# EAGLE design board 2 (EAGLE 9.6.2)
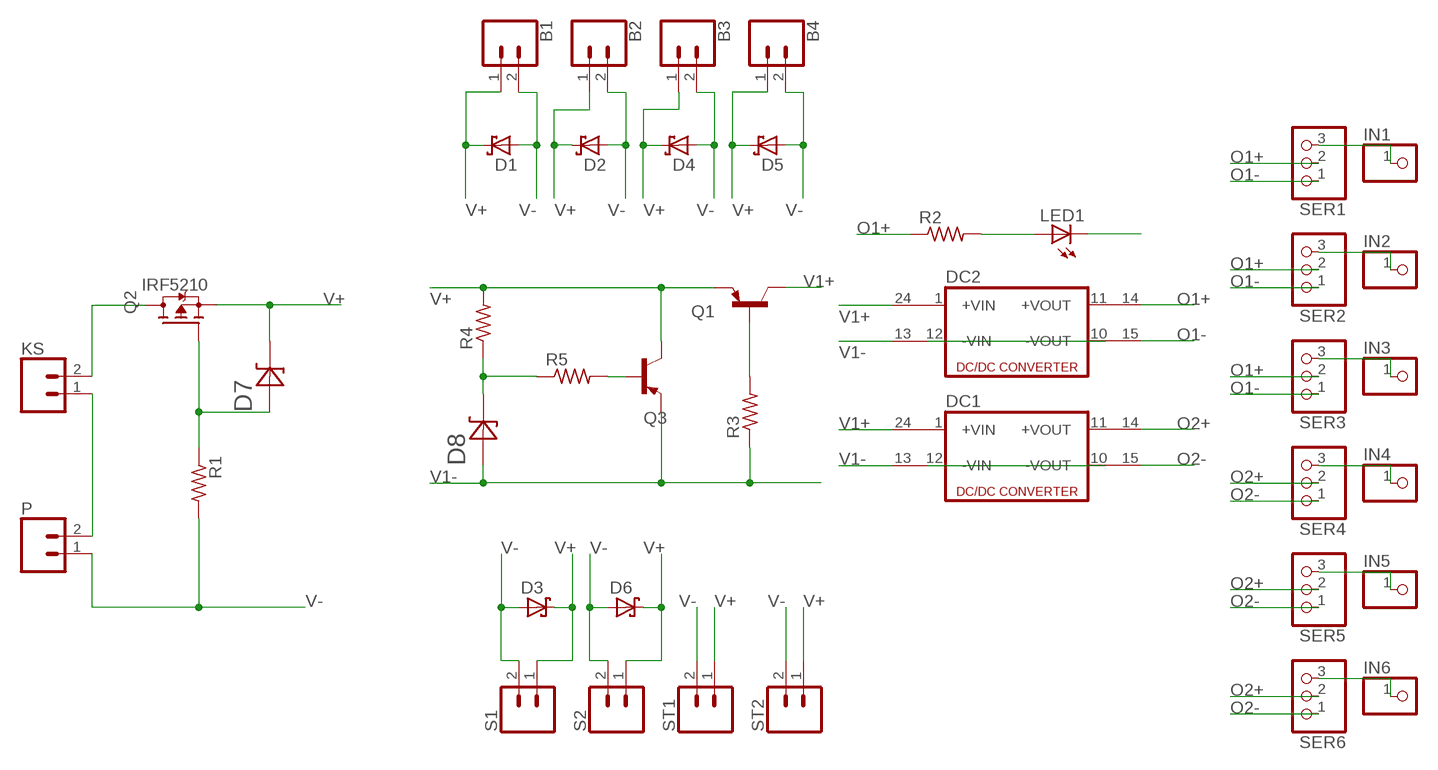
[diagram p0: schematic, sheet 1]

## Parts
B1  CONN_02  [1X02]
B2  CONN_02  [1X02]
B3  CONN_02  [1X02]
B4  CONN_02  [1X02]
D1  SCHOTTKY-DIODEF126Z12  [F126Z12]
D2  SCHOTTKY-DIODEF126Z12  [F126Z12]
D3  SCHOTTKY-DIODEF126Z12  [F126Z12]
D4  SCHOTTKY-DIODEF126Z12  [F126Z12]
D5  SCHOTTKY-DIODEF126Z12  [F126Z12]
D6  SCHOTTKY-DIODEF126Z12  [F126Z12]
D7  1N4752A-T  [DIOAD1060W80L410D260]
D8  1N4752A-T  [DIOAD1060W80L410D260]
DC1  DC213R  [CMK]
DC2  DC213R  [CMK]
IN1  PINHD-1X1  [1X01]
IN2  PINHD-1X1  [1X01]
IN3  PINHD-1X1  [1X01]
IN4  PINHD-1X1  [1X01]
IN5  PINHD-1X1  [1X01]
IN6  PINHD-1X1  [1X01]
KS  CONN_02  [1X02]
LED1  LED5MM  [LED5MM]
P  CONN_02  [1X02]
Q1  2N2907  [TO92-EBC-OVAL]
Q2  IRF5210  [TO254P1054X469X2933-3]
Q3  2N2907  [TO92-EBC-OVAL]
R1  R-US_0204/7  [0204/7]
R2  R-US_0204/7  [0204/7]
R3  R-US_0204/7  [0204/7]
R4  R-US_0204/7  [0204/7]
R5  R-US_0204/7  [0204/7]
S1  CONN_02  [1X02]
S2  CONN_02  [1X02]
SER1  PINHD-1X3  [1X03]
SER2  PINHD-1X3  [1X03]
SER3  PINHD-1X3  [1X03]
SER4  PINHD-1X3  [1X03]
SER5  PINHD-1X3  [1X03]
SER6  PINHD-1X3  [1X03]
ST1  CONN_02  [1X02]
ST2  CONN_02  [1X02]

## Nets
N$1: KS.1 P.2
N$2: KS.2 Q2.2(D)
N$3: D7.A Q2.1(G) R1.1
N$6: D8.C R4.1 R5.1
N$7: Q3.B R5.2
N$9: Q1.B R3.2
N$28: DC2.10(-VOUT) DC2.12(-VIN)
N$29: DC1.10(-VOUT) DC1.12(-VIN)
N$38: LED1.A R2.2
N$39: LED1.K(C)
N$53: IN1.1 SER1.3
N$54: IN2.1 SER2.3
N$55: IN3.1 SER3.3
N$56: IN4.1 SER4.3
N$57: IN5.1 SER5.3
N$58: IN6.1 SER6.3
O1+: DC2.14(+VOUT1) R2.1 SER1.2 SER2.2 SER3.2
O1-: DC2.15(-VOUT1) SER1.1 SER2.1 SER3.1
O2+: DC1.14(+VOUT1) SER4.2 SER5.2 SER6.2
O2-: DC1.15(-VOUT1) SER4.1 SER5.1 SER6.1
V1+: DC1.24(+VIN1) DC2.24(+VIN1) Q1.C
V1-: D8.A DC1.13(-VIN1) DC2.13(-VIN1) Q3.E R3.1
V+: B1.1 B2.1 B3.1 B4.1 D1.C D2.C D3.C D4.C D5.C D6.C D7.C Q1.E Q2.3(S) Q3.C R4.2 S1.1 S2.1 ST1.1 ST2.1
V-: B1.2 B2.2 B3.2 B4.2 D1.A D2.A D3.A D4.A D5.A D6.A P.1 R1.2 S1.2 S2.2 ST1.2 ST2.2
Unconnected: DC1.1(+VIN) DC1.11(+VOUT) DC2.1(+VIN) DC2.11(+VOUT)

## Library data of the parts
B1-B4 KS P S1 S2 ST1 ST2 = SparkFun-Connectors:CONN_02: Multi connection point. Often used as Generic Header-pin footprint for 0.1 inch spaced/style header connections On any of the 0.1 inch spaced packages, you can populate with these: Break Away Headers - Straight <https://www.sparkfun.com/products/116> (PRT-00116) Break Away Male Headers - Right Angle <https://www.sparkfun.com/products/553> (PRT-00553) Female Headers <https://www.sparkfun.com/products/115> (PRT-00115) Break Away Headers - Machine Pin <https://www.sparkfun.com/products/117> (PRT-00117) Break Away Female Headers - Swiss Machine Pin <https://www.sparkfun.com/products/743> (PRT-00743) For SCREWTERMINALS and SPRING TERMINALS visit here: Screw Terimnals on SparkFun.com <https://www.sparkfun.com/search/results?term=Screw+Terminals> (5mm/3.5mm/2.54mm spacing) This device is also useful as a general connection point to wire up your design to another part of your project. Our various solder wires solder well into these plated through hole pads. Hook-Up Wire - Assortment (Stranded, 22 AWG) <https://www.sparkfun.com/products/11375> (PRT-11375) Hook-Up Wire - Assortment (Solid Core, 22 AWG) <https://www.sparkfun.com/products/11367> (PRT-11367) View the entire wire category on our website here <https://www.sparkfun.com/categories/141> Special notes: Molex polarized connector foot print use with: PRT-08233 with associated crimp pins and housings. 2.54_SCREWTERM for use with PRT-10571. 3.5mm Screw Terminal footprints for PRT-08084 5mm Screw Terminal footprints for use with PRT-08432
D1-D6 = adafruit:SCHOTTKY-DIODE: Schottky Diode
D7 D8 = 1N4752A-T:1N4752A-T: DIODE ZENER 33V 1W DO41 Check prices <https://pricing.snapeda.com/parts/1N4752A/ON%20Semiconductor/view-part?ref=eda>; AVAILABILITY: In Stock; DESCRIPTION: Zener Diode 33 V 1 W ±5% Through Hole DO-41; MF: ON Semiconductor; MP: 1N4752A; PACKAGE: DO-41-2 ON Semiconductor; PRICE: None; PURCHASE-URL: https://pricing.snapeda.com/search/part/1N4752A/?ref=eda
DC1 DC2 = dc-dc-converter:DC213R: DC-DC CONVERTER; OC_FARNELL: unknown; OC_NEWARK: unknown
IN1-IN6 = pinhead:PINHD-1X1: PIN HEADER
LED1 = adafruit:LED: LED OSRAM: - CHIPLED LG R971, LG N971, LY N971, LG Q971, LY Q971, LO R971, LY R971 LH N974, LH R974 LS Q976, LO Q976, LY Q976 LO Q996 - Hyper CHIPLED LW Q18S LB Q993, LB Q99A, LB R99A - SideLED LS A670, LO A670, LY A670, LG A670, LP A670 LB A673, LV A673, LT A673, LW A673 LH A674 LY A675 LS A676, LA A676, LO A676, LY A676, LW A676 LS A679, LY A679, LG A679 - Hyper Micro SIDELED® LS Y876, LA Y876, LO Y876, LY Y876 LT Y87S - SmartLED LW L88C, LW L88S LB L89C, LB L89S, LG L890 LS L89K, LO L89K, LY L89K LS L896, LA L896, LO L896, LY L896 - TOPLED LS T670, LO T670, LY T670, LG T670, LP T670 LSG T670, LSP T670, LSY T670, LOP T670, LYG T670 LG T671, LOG T671, LSG T671 LB T673, LV T673, LT T673, LW T673 LH T674 LS T676, LA T676, LO T676, LY T676, LB T676, LH T676, LSB T676, LW T676 LB T67C, LV T67C, LT T67C, LS T67K, LO T67K, LY T67K, LW E67C LS E67B, LA E67B, LO E67B, LY E67B, LB E67C, LV E67C, LT E67C LW T67C LS T679, LY T679, LG T679 LS T770, LO T770, LY T770, LG T770, LP T770 LB T773, LV T773, LT T773, LW T773 LH T774 LS E675, LA E675, LY E675, LS T675 LS T776, LA T776, LO T776, LY T776, LB T776 LHGB T686 LT T68C, LB T68C - Hyper Mini TOPLED® LB M676 - Mini TOPLED Santana® LG M470 LS M47K, LO M47K, LY M47K Source: http://www.osram.convergy.de/
Q1 Q3 = adafruit:2N2907*: PNP Transistor Big Oval pads
Q2 = IRF5210:IRF5210: Check prices <https://pricing.snapeda.com/parts/IRF5210/Infineon%20Technologies/view-part?ref=eda>; AVAILABILITY: In Stock; DESCRIPTION: P-Channel 100V 38A (Tc) 3.1W (Ta), 170W (Tc) Surface Mount D2PAK; MF: Infineon Technologies; MP: IRF5210; PACKAGE: TO-220 Infineon; PRICE: None; PURCHASE-URL: https://pricing.snapeda.com/search/part/IRF5210/?ref=eda
R1-R5 = rcl:R-US_: RESISTOR, American symbol; SPICEPREFIX: R
SER1-SER6 = pinhead:PINHD-1X3: PIN HEADER

## Board
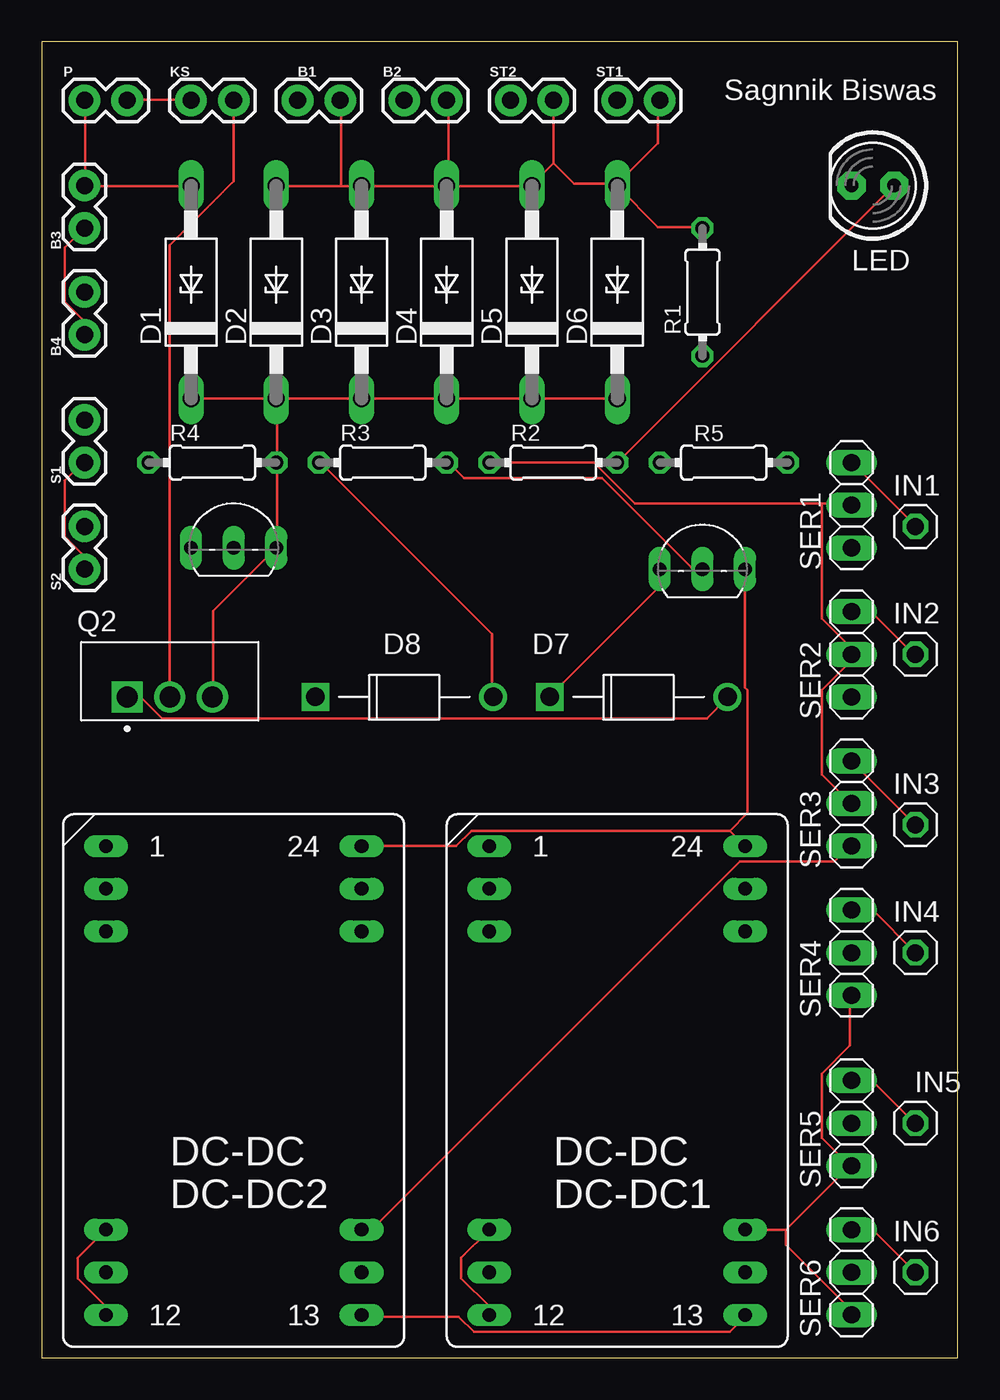
[diagram p1: board, top side]
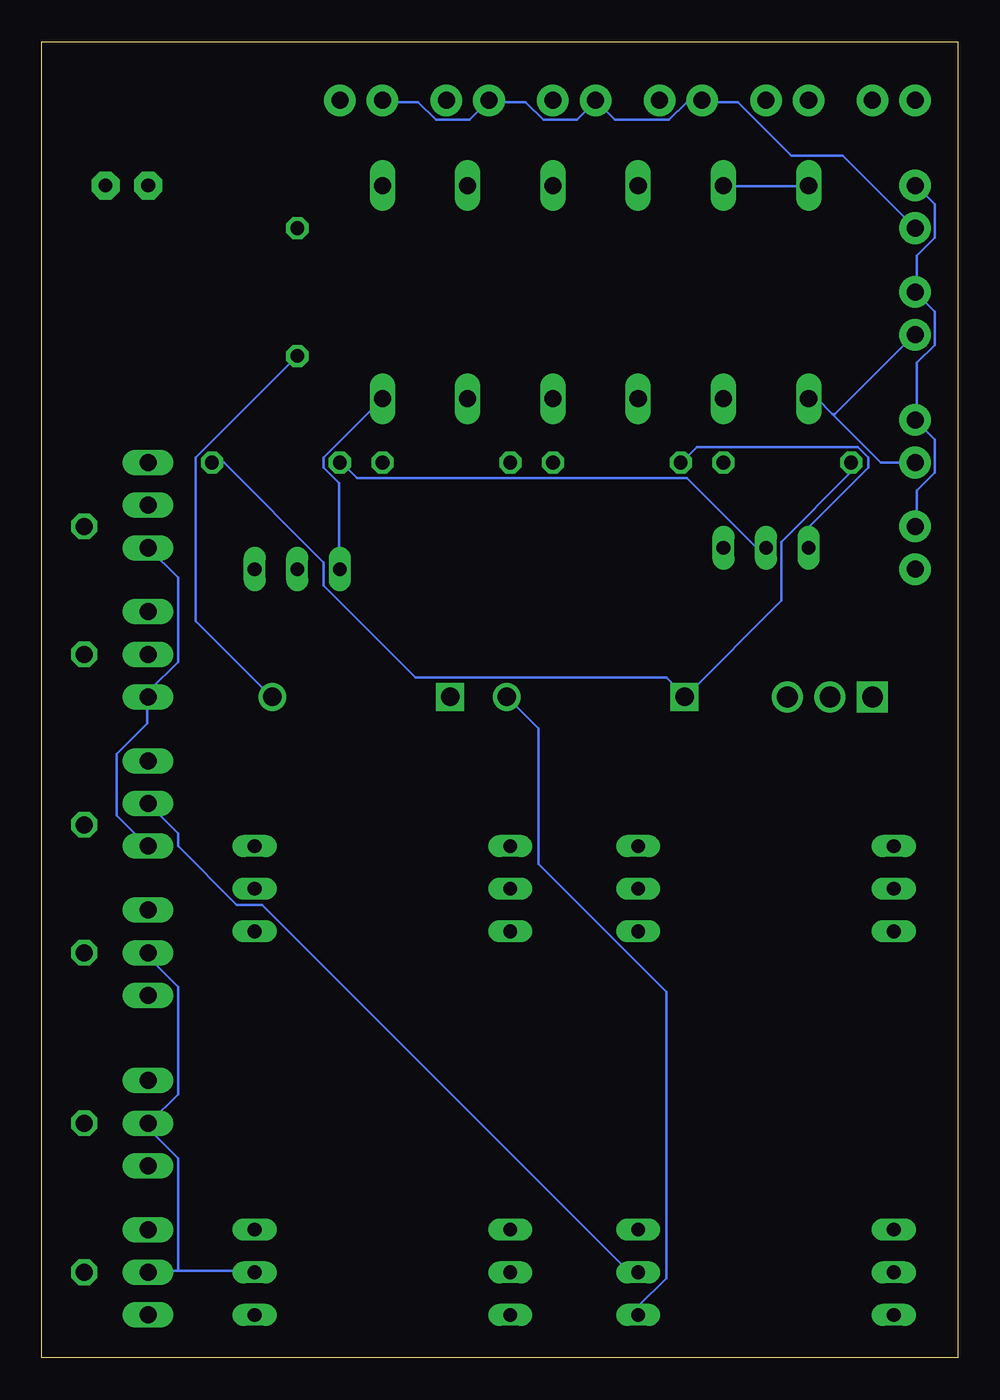
[diagram p2: board, bottom side, seen from below]

Size 54.59 x 78.41 mm. Coordinates in mm from the lower left corner, seen from the top.
Outline: 0,0 54.59,0 54.59,78.41 0,78.41 0,0
Copper layers (1*16): Top 0.035mm / dielectric 1.5mm / Bottom 0.035mm
Design rules "default": minimum track width 6mil, minimum drill 0.35mm, track to track 6mil, track to pad 6mil, pad to pad 6mil, via to via 6mil, smd to smd 6mil, copper to edge 40mil, drill to drill 6mil, minimum pad ring 10mil, minimum via ring 8mil, stop-mask expansion 4mil, vias tented up to drill 0mil, thermal gap 10mil

### Footprints (pad centres in the part's own frame; a part is rotated, then mirrored left to right if it is on the bottom)
1X02 = drill 1.016 pad 1.88: 1 0,0; 2 2.54,0
F126Z12 = drill 1.016 long: A 6.35,0; C -6.35,0
DIOAD1060W80L410D260 = drill 1.1 pad 1.65: A 5.3,0 | drill 1.1 pad 1.65 square: C -5.3,0
CMK = drill 0.813 long: 1 -7.62,13.97; 2 -7.62,11.43; 3 -7.62,8.89; 10 -7.62,-8.89; 11 -7.62,-11.43; 12 -7.62,-13.97; 13 7.62,-13.97; 14 7.62,-11.43; 15 7.62,-8.89; 22 7.62,8.89; 23 7.62,11.43; 24 7.62,13.97
1X01 = drill 1.016 octagon: 1 0,0
LED5MM = drill 0.813 pad 1.676 octagon: A -1.27,0; K 1.27,0
TO92-EBC-OVAL = drill 0.813 long: B 0,-1.27; C 2.54,-1.27; E -2.54,-1.27
TO254P1054X469X2933-3 = drill 1.23 pad 1.85 square: 1 0,0 | drill 1.23 pad 1.85: 2 2.54,0; 3 5.08,0
0204/7 = drill 0.813 octagon: 1 -3.81,0; 2 3.81,0
1X03 = drill 1.016 long: 1 -2.54,0; 2 0,0; 3 2.54,0

### Placement (x,y rotation side)
B1  15.24,74.93 0 top
B2  21.59,74.93 0 top
B3  2.54,67.31 90 top
B4  2.54,60.96 90 top
D1  8.89,63.5 90 top
D2  13.97,63.5 90 top
D3  19.05,63.5 90 top
D4  24.13,63.5 90 top
D5  29.21,63.5 90 top
D6  34.29,63.5 90 top
D7  35.56,39.37 0 top
D8  21.59,39.37 0 top
DC1  34.29,16.51 0 top
DC2  11.43,16.51 0 top
IN1  52.07,49.53 0 top
IN2  52.07,41.91 0 top
IN3  52.07,31.75 0 top
IN4  52.07,24.13 0 top
IN5  52.07,13.97 0 top
IN6  52.07,5.08 0 top
KS  8.89,74.93 0 top
LED1  49.53,69.85 180 top
P  2.54,74.93 0 top
Q1  39.37,48.26 0 top
Q2  5.08,39.37 0 top
Q3  11.43,49.53 0 top
R1  39.37,63.5 90 top
R2  30.48,53.34 0 top
R3  20.32,53.34 0 top
R4  10.16,53.34 0 top
R5  40.64,53.34 180 top
S1  2.54,53.34 90 top
S2  2.54,46.99 90 top
SER1  48.26,50.8 90 top
SER2  48.26,41.91 90 top
SER3  48.26,33.02 90 top
SER4  48.26,24.13 90 top
SER5  48.26,13.97 90 top
SER6  48.26,5.08 90 top
ST1  34.29,74.93 0 top
ST2  27.94,74.93 0 top

### Tracks (layer width: path | path; a pad name or v marks a point on that pad's centre or on a via)
N$1
  Top 0.152: P.2 5.18,74.98 8.84,74.98 KS.1
N$2
  Top 0.152: Q2.2 7.62,66.29 11.43,70.1 KS.2
N$3
  Top 0.152: Q2.1 5.18,39.32 5.94,39.32 7.16,38.1 39.62,38.1 40.84,39.32 D7.A
  Bottom 0.152: R1.1 45.41,53.65 45.41,43.89 41,39.47 D7.A
N$6
  Bottom 0.152: R4.1 6.4,53.34 6.4,52.73 10.52,48.62 10.52,45.11 16.15,39.47 D8.C 16.31,39.47 17.37,40.54 32.31,40.54 37.8,46.02 37.8,47.4 43.74,53.34 R5.1
N$7
  Bottom 0.152: Q3.B 11.43,48.31 12.04,48.31 16.15,52.43 35.81,52.43 36.73,53.34 R5.2
N$9
  Top 0.152: Q1.B 39.32,47.09 38.71,47.09 33.38,52.43 25.15,52.43 24.23,53.34 R3.2
N$28
  Top 0.152: DC2.12 3.81,3.05 2.13,4.72 2.13,5.94 DC2.10
N$29
  Top 0.152: DC1.12 26.67,3.05 24.99,4.72 24.99,5.94 DC1.10
N$38
  Top 0.152: R2.2 50.75,69.8 50.75,69.85 LED1.A
N$53
  Top 0.152: SER1.3 48.31,53.34 52.12,49.53 IN1.1
N$54
  Top 0.152: SER2.3 48.31,44.35 49.53,44.35 51.97,41.91 IN2.1
N$55
  Top 0.152: IN3.1 SER3.3
N$56
  Top 0.152: SER4.3 49.53,26.67 IN4.1
N$57
  Top 0.152: SER5.3 48.31,16.46 49.53,16.46 51.97,14.02 IN5.1
N$58
  Top 0.152: SER6.3 49.53,7.62 IN6.1
O1+
  Top 0.152: R2.1 32.92,53.34 35.36,50.9 46.48,50.9 | 46.48,50.9 48.16,50.9 SER1.2 | 48.16,41.91 48.16,42.37 46.48,44.04 46.48,50.9 | 48.16,41.91 48.16,41.45 46.48,39.78 46.48,34.75 48.16,33.07 SER3.2 | 48.16,41.91 SER2.2
  Bottom 0.152: SER3.2 46.48,31.24 46.48,30.48 42.98,26.98 41.45,26.98 19.66,5.18 19.05,5.18 DC2.14
O1-
  Top 0.152: DC2.15 19.66,7.62 41.6,29.57 47.24,29.57 48.16,30.48 SER3.1
  Bottom 0.152: SER1.1 46.48,46.48 46.48,41.45 48.16,39.78 48.16,39.47 SER2.1 48.31,39.32 48.31,37.8 50.14,35.97 50.14,32.31 48.31,30.48 SER3.1
O2+
  Bottom 0.152: 46.48,5.18 48.16,5.18 SER6.2 | 46.48,5.18 41.91,5.18 DC1.14 | 46.48,5.18 46.48,11.89 48.16,13.56 48.16,13.87 SER5.2 48.16,14.02 46.48,15.7 46.48,22.1 48.16,23.77 48.16,24.08 SER4.2
O2-
  Top 0.152: 44.35,7.62 DC1.15 | 48.16,11.43 44.35,7.62 | 44.35,7.62 44.35,6.71 48.16,2.9 48.16,2.59 SER6.1 | 48.16,11.43 46.48,13.11 46.48,16.92 48.16,18.59 48.16,21.49 SER4.1 | 48.16,11.43 SER5.1
V1+
  Top 0.152: DC2.24 24.69,30.48 25.6,31.39 41,31.39 | DC1.24 41,31.39 | Q1.C 41.91,39.93 42.06,39.78 42.06,32.46 41,31.39
V1-
  Top 0.152: DC2.13 19.05,2.44 24.84,2.44 25.76,1.52 41,1.52 41.91,2.44 DC1.13 | D8.A 26.82,39.47 26.82,43.13 16.61,53.34 R3.1
  Bottom 0.152: Q3.E 8.84,48.31 8.84,49.53 5.33,53.03 5.33,53.65 5.94,54.25 15.54,54.25 16.46,53.34 R3.1 | DC2.13 19.05,3.05 17.37,4.72 17.37,21.79 24.99,29.41 24.99,37.49 26.82,39.32 D8.A
V+
  Top 0.152: 14.02,53.34 14.02,48.31 Q3.C 10.21,44.5 10.21,39.47 Q2.3 | Q1.E 36.73,46.94 36.73,45.87 30.33,39.47 D7.C | D6.C D5.C D4.C D3.C 14.02,57.15 | B3.1 1.37,66.14 1.37,62.94 2.44,61.87 2.44,60.96 B4.1 | S2.1 2.44,47.09 2.44,47.85 1.37,48.92 1.37,52.27 2.44,53.34 S1.1 | D1.C D2.C 14.02,57.15 | 14.02,57.15 14.02,53.34 | 14.02,53.34 R4.2
  Bottom 0.152: 15.24,74.83 16.15,74.83 17.22,73.76 20.42,73.76 B2.1 21.64,74.83 22.71,73.76 24.69,73.76 25.76,74.83 27.89,74.83 ST2.1 29.11,73.76 31.09,73.76 32.16,74.83 34.29,74.83 ST1.1 | S1.1 4.57,53.34 7.47,56.24 | 7.47,56.24 8.38,57.15 D1.C | 7.47,56.24 7.32,56.24 2.59,60.96 B4.1 | D6.C 37.8,53.65 37.8,53.03 36.88,52.12 36.88,47.09 Q1.E | 15.24,74.83 13.11,74.83 9.91,71.63 6.86,71.63 B3.1 | 15.24,74.83 B1.1
V-
  Top 0.152: P.1 2.59,74.83 2.59,69.95 B3.2 2.59,69.8 8.84,69.8 D1.A | 17.83,69.8 14.02,69.8 D2.A | 17.83,69.8 19.05,69.8 | 17.83,69.8 17.83,74.83 B1.2 | R1.2 39.32,67.36 36.73,67.36 34.29,69.8 D6.A 34.29,69.95 | 34.29,69.95 36.73,72.39 36.73,74.83 ST1.2 | D4.A 24.23,69.8 29.11,69.8 D5.A 29.26,69.95 30.48,71.17 | B2.2 24.23,74.83 24.23,69.95 D4.A | 30.48,71.17 ST2.2 | 34.29,69.95 31.7,69.95 30.48,71.17 | 19.05,69.8 24.08,69.8 D4.A | 19.05,69.8 D3.A
  Bottom 0.152: S2.2 2.44,49.53 2.44,51.66 1.37,52.73 1.37,54.71 S1.2 2.44,55.93 2.44,59.28 1.37,60.35 1.37,62.33 B4.2 2.44,63.55 2.44,65.68 1.37,66.75 1.37,68.73 2.44,69.8 B3.2 | D1.A 8.99,69.8 13.87,69.8 D2.A

### Text on the board
tNames: Sagnnik Biswas | LED | D8 | D7 | DC-DC2 | DC-DC1